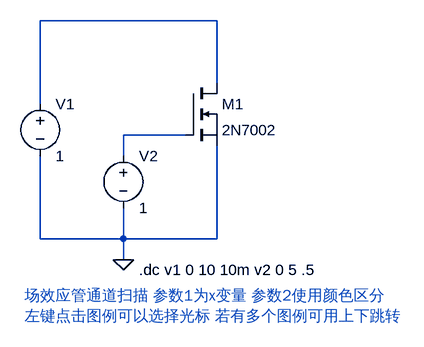
[diagram p0: schematic Draft1.asc]
Draft1.asc, the LTspice schematic file:
Version 4
SHEET 1 880 680
WIRE 400 128 128 128
WIRE 400 224 400 128
WIRE 128 256 128 128
WIRE 352 304 256 304
WIRE 256 336 256 304
WIRE 128 464 128 336
WIRE 256 464 256 416
WIRE 256 464 128 464
WIRE 400 464 400 320
WIRE 400 464 256 464
WIRE 256 496 256 464
FLAG 256 496 0
SYMBOL Voltage 128 240 R0
SYMATTR InstName V1
SYMATTR Value 1
SYMBOL Voltage 256 320 R0
SYMATTR InstName V2
SYMATTR Value 1
SYMBOL nmos 352 224 R0
SYMATTR InstName M1
SYMATTR Value 2N7002
TEXT 280 512 Left 2 !.dc v1 0 10 10m v2 0 5 .5
TEXT 104 552 Left 2 ;场效应管通道扫描 参数1为x变量 参数2使用颜色区分\n左键点击图例可以选择光标 若有多个图例可用上下跳转

The netlist it stands for:
* Draft1.asc
V1 N001 0 1
V2 N002 0 1
M1 N001 N002 0 0 2N7002
.model NMOS NMOS
.model PMOS PMOS
.lib standard.mos
.dc v1 0 10 10m v2 0 5 .5
* 场效应管通道扫描 参数1为x变量 参数2使用颜色区分
* 左键点击图例可以选择光标 若有多个图例可用上下跳转
.backanno
.end